# EAGLE board Imagenotifier (EAGLE 7.5.0), part 1 of 2
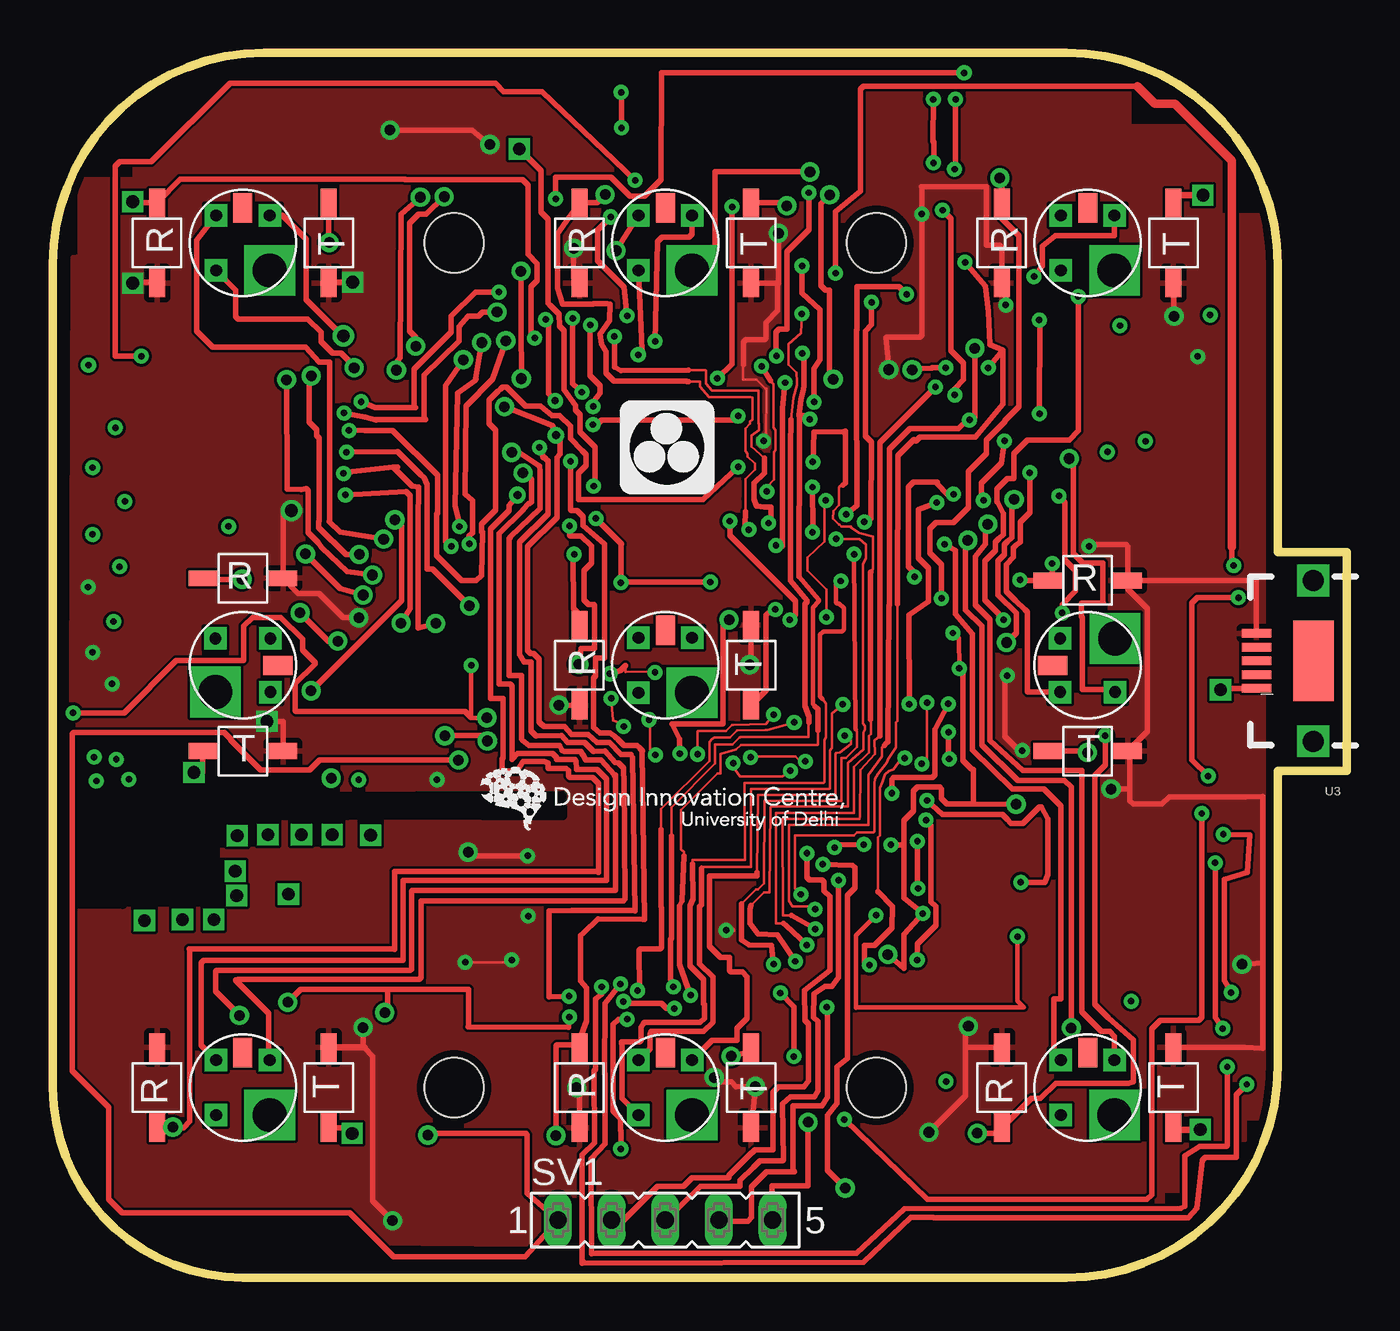
[diagram p1: board, top side]
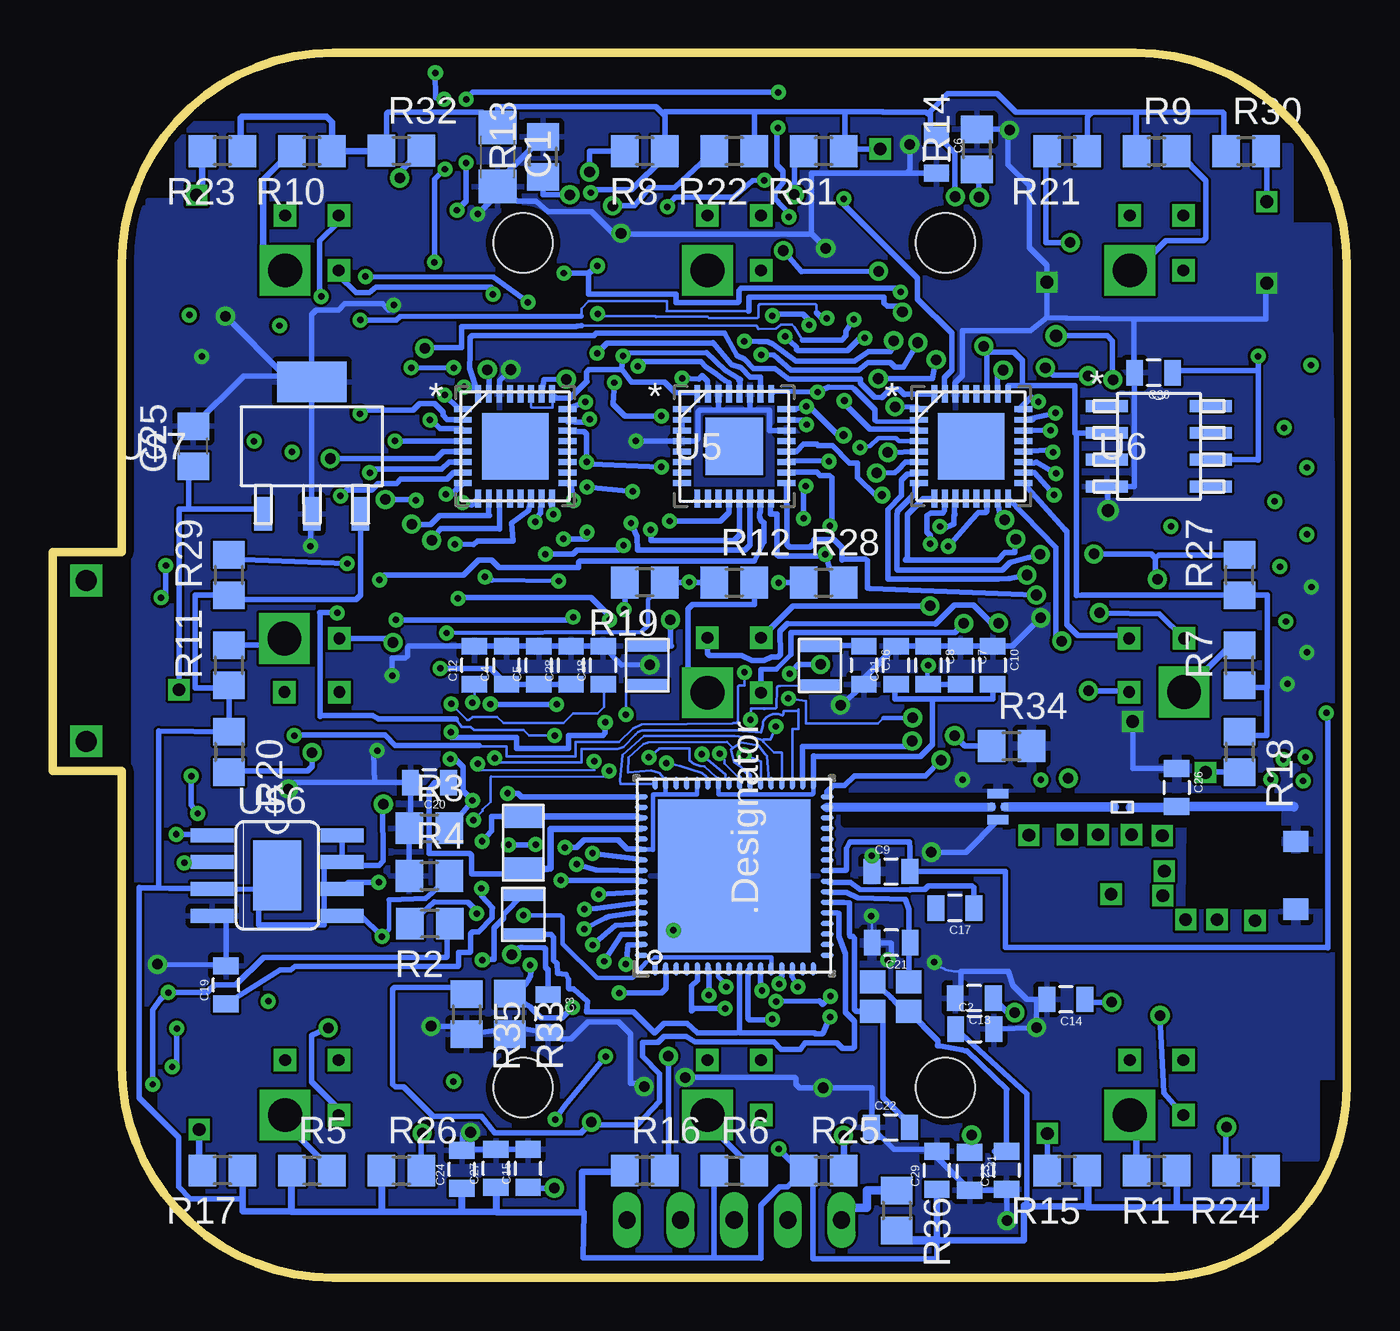
[diagram p2: board, bottom side, seen from below]

Size 61.26 x 58 mm. Coordinates in mm from the lower left corner, seen from the top.
Outline: 10,58 48,58 arc-90 58,48 58,34.37 61.27,34.37 61.27,24 58,24 58,10 arc-90 48,0 9,0 arc-90 0,9 0,48 arc-90 10,58
Copper layers (1*16): Top 0.035mm / dielectric 1.5mm / Bottom 0.035mm
Design rules "default *": minimum track width 5mil, minimum drill 10mil, track to track 5mil, track to pad 5mil, pad to pad 5mil, via to via 5mil, smd to smd 0mil, copper to edge 14mil, drill to drill 14mil, minimum pad ring 10mil, minimum via ring 8mil, stop-mask expansion 4mil, vias tented up to drill 0mil, thermal gap 10mil
Holes 2.8 mm at 39,49 19,9 39,9 19,49
tRestrict: area 3.3,17.8 to 24.2,22.9; area 0.9,17.7 to 3.3,19.8
bRestrict: area 3.3,17.7 to 23.8,22.8; area 0.8,17.7 to 3.3,19.9

## Footprints (pad centres in the part's own frame; a part is rotated, then mirrored left to right if it is on the bottom)
IRTRANSCIEVER = smd 1.35 x 0.75: 1 -1.9,0; 2 1.9,0
C1206 = smd 1.6 x 1.8: 1 -1.4,0; 2 1.4,0
0805 = smd 0.8 x 1.2: 1 -0.9,0; 2 0.9,0
C0805 = smd 1.3 x 1.5: 1 -0.95,0; 2 0.95,0
RGC0064A = smd 0.61 x 0.229: 1 -4.4,3.75; 2 -4.4,3.25; 3 -4.4,2.75; 4 -4.4,2.25; 5 -4.4,1.75; 6 -4.4,1.25; 7 -4.4,0.75; 8 -4.4,0.25; 9 -4.4,-0.25; 10 -4.4,-0.75; 11 -4.4,-1.25; 12 -4.4,-1.75; 13 -4.4,-2.25; 14 -4.4,-2.75; 15 -4.4,-3.25; 16 -4.4,-3.75; 33 4.4,-3.75; 34 4.4,-3.25; 35 4.4,-2.75; 36 4.4,-2.25; 37 4.4,-1.75; 38 4.4,-1.25; 39 4.4,-0.75; 40 4.4,-0.25; 41 4.4,0.25; 42 4.4,0.75; 43 4.4,1.25; 44 4.4,1.75; 45 4.4,2.25; 46 4.4,2.75; 47 4.4,3.25; 48 4.4,3.75 | smd 0.229 x 0.61: 17 -3.751,-4.4; 18 -3.251,-4.4; 19 -2.751,-4.4; 20 -2.251,-4.4; 21 -1.75,-4.4; 22 -1.25,-4.4; 23 -0.75,-4.4; 24 -0.25,-4.4; 25 0.25,-4.4; 26 0.75,-4.4; 27 1.25,-4.4; 28 1.75,-4.4; 29 2.251,-4.4; 30 2.751,-4.4; 31 3.251,-4.4; 32 3.751,-4.4; 49 3.751,4.4; 50 3.251,4.4; 51 2.751,4.4; 52 2.251,4.4; 53 1.75,4.4; 54 1.25,4.4; 55 0.75,4.4; 56 0.25,4.4; 57 -0.25,4.4; 58 -0.75,4.4; 59 -1.25,4.4; 60 -1.75,4.4; 61 -2.251,4.4; 62 -2.751,4.4; 63 -3.251,4.4; 64 -3.751,4.4 | smd 7.239 x 7.239: 65 0,0 | smd 0.508 x 0.508: V -1.136,0
ABS07-32.768KHZ-T = smd 1.092 x 1.905: P$1 -1.245,0; P$2 1.245,0
R0805 = smd 1.3 x 1.5: 1 -0.95,0; 2 0.95,0
FE05-1 = drill 0.813 long: 1 -5.08,0; 2 -2.54,0; 3 0,0; 4 2.54,0; 5 5.08,0
RHB32_3P15X3P15 = smd 0.838 x 0.279: 1 -2.475,1.75; 2 -2.475,1.25; 3 -2.475,0.75; 4 -2.475,0.25; 5 -2.475,-0.25; 6 -2.475,-0.75; 7 -2.475,-1.25; 8 -2.475,-1.75; 17 2.475,-1.75; 18 2.475,-1.25; 19 2.475,-0.75; 20 2.475,-0.25; 21 2.475,0.25; 22 2.475,0.75; 23 2.475,1.25; 24 2.475,1.75 | smd 0.279 x 0.838: 9 -1.75,-2.475; 10 -1.25,-2.475; 11 -0.75,-2.475; 12 -0.25,-2.475; 13 0.25,-2.475; 14 0.75,-2.475; 15 1.25,-2.475; 16 1.75,-2.475; 25 1.75,2.475; 26 1.25,2.475; 27 0.75,2.475; 28 0.25,2.475; 29 -0.25,2.475; 30 -0.75,2.475; 31 -1.25,2.475; 32 -1.75,2.475 | smd 3.15 x 3.15: 33 0,0
USB-MICRO-SMD = smd 1.4 x 0.4: D+1 2.7,0; D-1 2.7,0.65; GND1 2.7,-1.3; ID1 2.7,-0.65; VBUS1 2.7,1.3 | drill 1 square: P$1 0,3.81; P$2 0,-3.81 | smd 1.93 x 3.81: P$3 0,0
RHB32_2P7X2P7 = smd 0.838 x 0.279: 1 -2.475,1.75; 2 -2.475,1.25; 3 -2.475,0.75; 4 -2.475,0.25; 5 -2.475,-0.25; 6 -2.475,-0.75; 7 -2.475,-1.25; 8 -2.475,-1.75; 17 2.475,-1.75; 18 2.475,-1.25; 19 2.475,-0.75; 20 2.475,-0.25; 21 2.475,0.25; 22 2.475,0.75; 23 2.475,1.25; 24 2.475,1.75 | smd 0.279 x 0.838: 9 -1.75,-2.475; 10 -1.25,-2.475; 11 -0.75,-2.475; 12 -0.25,-2.475; 13 0.25,-2.475; 14 0.75,-2.475; 15 1.25,-2.475; 16 1.75,-2.475; 25 1.75,2.475; 26 1.25,2.475; 27 0.75,2.475; 28 0.25,2.475; 29 -0.25,2.475; 30 -0.75,2.475; 31 -1.25,2.475; 32 -1.75,2.475 | smd 2.718 x 2.718: 33 0,0
D8 = smd 1.981 x 0.559: 1 -2.464,1.905; 2 -2.464,0.635; 3 -2.464,-0.635; 4 -2.464,-1.905; 5 2.464,-1.905; 6 2.464,-0.635; 7 2.464,0.635; 8 2.464,1.905
1008IND2.2UH = smd 0.6 x 2: P$1 -0.95,0; P$2 0.95,0
Q24FA20H00396 = smd 1.2 x 1.1: 1 -0.85,-0.7; 2 0.85,-0.7; 3 0.85,0.7; 4 -0.85,0.7
SO08 = smd 0.66 x 2.032: 1 -1.905,-3.073; 2 -0.635,-3.073; 3 0.635,-3.073; 4 1.905,-3.073; 5 1.905,3.073; 6 0.635,3.073; 7 -0.635,3.073; 8 -1.905,3.073 | smd 3.327 x 2.286: P$1 0,0
MP04A = smd 3.302 x 1.905: GND 0,3.048 | smd 0.838 x 1.6: GND2 0,-3.2; IN -2.3,-3.2; OUT 2.3,-3.2
DEA202450BT-1294C1-H = smd 0.35 x 0.35: 1 0,-0.325; 3 0,0.325 | smd 0.45 x 1: 2 0.625,0; 4 -0.625,0
0402INDUCTOR3.6NH = smd 0.25 x 0.5: P$1 0.375,0; P$4 -0.375,0
ANTENNA-AH316M245001-T = smd 1 x 1.2: G 1.6,0; S -1.6,0
0.25WATT_RGB_THROUGH = drill 0.559 pad 1.016 square: B -1.27,1.3; G -1.27,-1.3; R 1.27,1.3 | drill 1.6 square: P2 1.27,-1.3 | smd 0.9 x 1.397: P$3 0,1.651
IRREIVER = smd 1.35 x 0.75: 1 -1.9,0; 2 1.9,0

## Placement (x,y rotation side)
1  IRTRANS  [IRTRANSCIEVER]  13.06,9 90 top
C1  33uF  [C1206]  40.21,53.07 270 bottom
C2  0.1uF  [0805]  17.61,11.78 0 bottom
C3  0.1uF  [0805]  37.82,12.5 270 bottom
C4  4.7uF  [0805]  39.78,29 90 bottom
C5  4.7uF  [0805]  38.25,29 90 bottom
C6  4.7uF  [0805]  19.43,53.21 270 bottom
C7  0.1uF  [0805]  18.29,29 270 bottom
C8  0.1uF  [0805]  19.81,29 270 bottom
C9  0.1uF  [0805]  21.58,19.24 0 bottom
C10  0.1uF  [0805]  16.76,29 270 bottom
C11  22uF  [0805]  21.34,29 90 bottom
C12  22uF  [0805]  41.3,29 90 bottom
C13  10uF  [0805]  17.64,13.24 180 bottom
C14  0.1uF  [0805]  13.3,13.18 180 bottom
C15  0.1uF  [0805]  38.76,5.18 90 bottom
C16  10uF  [0805]  22.86,29 270 bottom
C17  0.1uF  [0805]  18.56,17.5 180 bottom
C18  0.1uF  [0805]  35.2,29 90 bottom
C19  10pF  [0805]  53.06,13.87 90 bottom
C20  10pF  [0805]  43.43,23.44 180 bottom
C21  6.2pF  [0805]  21.57,15.86 180 bottom
C22  6.2pF  [0805]  21.6,7.12 0 bottom
C23  0.1  [0805]  16.1,5.08 90 bottom
C24  1uF  [0805]  41.9,5.13 90 bottom
C25  0.47uF  [C0805]  54.61,39.37 90 bottom
C26  1pF  [0805]  8.05,23.22 270 bottom
C27  100nF  [0805]  40.28,5.18 90 bottom
C28  100nF  [0805]  36.73,29 90 bottom
C29  10uF  [0805]  19.41,5.08 90 bottom
C30  10uF  [0805]  9.14,42.85 180 bottom
C31  0.1uF  [0805]  17.85,5.03 270 bottom
CC3200  Value  [RGC0064A]  29,19.02 90 bottom
CRYSTAL  ABS07-32.768KHZ-T  [ABS07-32.768KHZ-T]  38.99,20.6 270 bottom
R1  [R0805]  9,5.08 180 bottom
R2  100K  [R0805]  43.41,16.76 180 bottom
R3  100K  [R0805]  43.43,21.29 0 bottom
R4  100K  [R0805]  43.43,19.02 0 bottom
R5  [R0805]  49,5.08 0 bottom
R6  [R0805]  29,5.08 0 bottom
R7  [R0805]  5.08,29 90 bottom
R8  [R0805]  33.23,53.34 180 bottom
R9  [R0805]  9,53.34 0 bottom
R10  [R0805]  49,53.34 180 bottom
R11  [R0805]  52.92,29 90 bottom
R12  [R0805]  29,32.92 0 bottom
R13  [R0805]  38.05,53.08 90 bottom
R14  [R0805]  17.51,53.42 90 bottom
R15  [R0805]  13.23,5.08 180 bottom
R16  [R0805]  33.23,5.08 0 bottom
R17  [R0805]  53.23,5.08 180 bottom
R18  [R0805]  5.08,24.89 270 bottom
R19  [R0805]  33.23,32.92 180 bottom
R20  [R0805]  52.92,24.89 270 bottom
R21  [R0805]  13.23,53.34 180 bottom
R22  [R0805]  29,53.34 180 bottom
R23  [R0805]  53.23,53.34 180 bottom
R24  [R0805]  4.77,5.08 180 bottom
R25  [R0805]  24.76,5.08 0 bottom
R26  [R0805]  44.76,5.08 0 bottom
R27  [R0805]  5.08,33.27 90 bottom
R28  [R0805]  24.76,32.92 0 bottom
R29  [R0805]  52.92,33.27 90 bottom
R30  [R0805]  4.77,53.34 0 bottom
R31  [R0805]  24.76,53.34 180 bottom
R32  [R0805]  44.76,53.37 0 bottom
R33  100k  [R0805]  39.63,12.49 270 bottom
R34  100k  [R0805]  15.87,25.17 0 bottom
R35  2.7k  [R0805]  41.67,12.47 270 bottom
R36  100k  [R0805]  21.3,3.18 270 bottom
SV1  [FE05-1]  29,2.73 0 top
U1  TLC5941_RHB_32  [RHB32_3P15X3P15]  17.78,39.37 0 bottom
U2  TLC5941_RHB_32  [RHB32_3P15X3P15]  39.37,39.37 0 bottom
U3  [USB-MICRO-SMD]  59.69,29.21 180 top
U5  ADS7961_RHB_32  [RHB32_2P7X2P7]  29,39.37 0 bottom
U6  REF5025_D_8  [D8]  8.89,39.37 0 bottom
U$1  IND1UH1008P  [1008IND2.2UH]  33.12,29 270 bottom
U$2  IND2.6UH1008P  [1008IND2.2UH]  24.94,28.98 270 bottom
U$3  IND2.6UH1008P  [1008IND2.2UH]  38.99,17.2 90 bottom
U$5  Q24FA20H00396  [Q24FA20H00396]  21.59,13.31 180 bottom
U$6  FLASHM25PX80  [SO08]  50.64,19.04 270 bottom
U$7  LM3940  [MP04A]  49,39.37 0 bottom
U$8  DEA202450BT-1294C1-H  [DEA202450BT-1294C1-H]  16.51,22.3 270 bottom
U$9  IND3.6NH402P  [0402INDUCTOR3.6NH]  10.62,22.28 0 bottom
U$10  ANTENNAE-AH316M245001-T  [ANTENNA-AH316M245001-T]  2.41,19.05 270 bottom
U$11  RGBLED  [0.25WATT_RGB_THROUGH]  9,9 0 top
U$12  RGBLED  [0.25WATT_RGB_THROUGH]  9,29 270 top
U$13  RGBLED  [0.25WATT_RGB_THROUGH]  29,29 0 top
U$14  RGBLED  [0.25WATT_RGB_THROUGH]  49,9 0 top
U$15  RGBLED  [0.25WATT_RGB_THROUGH]  9,49 0 top
U$16  RGBLED  [0.25WATT_RGB_THROUGH]  49,29 90 top
U$17  RGBLED  [0.25WATT_RGB_THROUGH]  29,9 0 top
U$18  RGBLED  [0.25WATT_RGB_THROUGH]  29,49 0 top
U$19  RGBLED  [0.25WATT_RGB_THROUGH]  49,49 0 top
U$20  IRTRANS  [IRTRANSCIEVER]  53.06,49 270 top
U$22  IRTRANS  [IRTRANSCIEVER]  33.06,9 270 top
U$23  IRTRANS  [IRTRANSCIEVER]  53.06,9 90 top
U$24  IRTRANS  [IRTRANSCIEVER]  9,24.94 0 top
U$25  IRTRANS  [IRTRANSCIEVER]  33.06,29 90 top
U$26  IRTRANS  [IRTRANSCIEVER]  49,24.94 0 top
U$27  IRTRANS  [IRTRANSCIEVER]  13.06,49 270 top
U$28  IRTRANS  [IRTRANSCIEVER]  33.06,49 270 top
U$29  IRREC  [IRREIVER]  4.94,9 270 top
U$31  IRREC  [IRREIVER]  24.94,9 90 top
U$33  IRREC  [IRREIVER]  44.94,9 270 top
U$35  IRREC  [IRREIVER]  9,33.12 180 top
U$37  IRREC  [IRREIVER]  24.94,29 90 top
U$39  IRREC  [IRREIVER]  49,33.02 180 top
U$41  IRREC  [IRREIVER]  4.94,49 90 top
U$43  IRREC  [IRREIVER]  24.94,49 90 top
U$44  IRREC  [IRREIVER]  44.94,49 90 top

## Tracks (layer width: path | path; a pad name or v marks a point on that pad's centre or on a via)
BLANK  (via drill 0.3, 0.5)
  Top 0.127: v35.42,18.15 35.14,18.43 35.14,20.94 37.94,20.94 38.08,21.08 38.86,21.08 38.9,21.12 38.9,23.4 38.92,23.62 39.07,23.86 39.48,24.4 39.55,24.54 39.91,25.11 39.91,26.29 40,26.37 40,31.91
  Top 0.254: v40.69,42.99 40.73,43.05 41.62,43.06 41.65,43.09 v42.29,43.09 | 40,31.91 40.02,38.92 40.78,39.69 40.86,39.61 40.88,39.61 41.07,39.8 43.68,39.8 45,41.36 45,43.93 | v44.3,43.09 45,43.93 | v23.81,51.08 23.81,52.1 26.44,52.1 27.32,51.22 28.02,51.22 28.79,51.99 28.81,57.05 v43.15,57.05 | v42.75,55.8 42.75,52.5 v42.7,52.49 | v43.19,48.08 44.15,46.96 44.3,45.74 44.38,44.18 45,43.93
  Bottom 0.254: U2.31 40.61,41.85 40.61,42.54 40.71,43.03 v40.69,42.99 | CC3200.58 v35.42,18.15 | v42.29,43.09 42.41,43.07 v44.3,43.09 | v23.81,51.08 23.81,50.82 20.32,47.33 20.32,46.34 18.69,44.72 18.69,42.98 19.05,42.62 19.05,41.86 U1.31 | v43.15,57.05 43.13,55.87 v42.75,55.8 | v42.7,52.49 43.19,52.01 v43.19,48.08
CS  (via drill 0.3)
  Top 0.127: 32.61,17.71 33.28,18.38 33.39,18.38 33.68,18.67 33.69,22.58 37.34,22.58 37.35,22.59 37.34,22.59 37.34,24.6 37.36,24.61 37.55,24.61 38.07,25.14 38.07,25.85 38.03,25.96
  Top 0.203: 38.03,25.96 38.01,25.98 v37.94,34.26
  Top 0.254: v34.13,14.84 34.02,15.74 32.97,15.76 32.61,16.01 32.61,17.54 32.61,17.71 | v34.24,34.68 34.54,34.66 34.54,41.14 34.55,41.14 v34.68,42.38 | v25.58,40.4 25.78,40.4 25.99,40.61 32.23,40.61 v32.45,40.8
  Bottom 0.254: CC3200.63 34.02,15.77 v34.13,14.84 | U5.23 25.8,40.62 v25.58,40.4 | v32.45,40.8 34.17,40.8 34.73,41.36 v34.68,42.38 | v34.24,34.68 34.47,34.45 36.45,34.45 36.64,34.26 v37.94,34.26
GND  (via drill 0.3, 0.5, 0.6)
  Top 0.127: v19.53,14.94 21.48,14.94 arc45 v21.73,15.04 | v22.51,17.13 22.79,17.13 | v31.88,16.45 32.25,16.43 arc45 32.22,16.52 | v22.48,19.97 arc45 v22.49,19.97 22.51,19.95 | v33.66,39.62 33.77,39.7 33.79,42.1 33.74,42.1 33.33,42.52 32.7,42.52 32.69,42.53 32.69,43.22 32.7,43.23
  Top 0.254: U3.GND1 56.99,33.02 U$39.1 | 25.02,7.1 U$31.1 24.94,8.85 v24.79,8.99 | v11.3,36.32 10.9,36.32 U$35.1 11.62,32.4 12.6,32.4 13.76,31.25 v14.49,31.25 | v14.2,47.14 13.06,47.14 U$27.2 | U$41.1 5.08,47.1 5.08,47.14 3.78,47.14 v3.78,47.09 | v10.13,26.34 10.9,26.34 U$24.2 | U$22.2 33.09,7.1 v33.27,9.05 32.35,9.04 32.13,9.26 31.59,9.26 v31.32,9.48 | U$20.2 53.09,47.07 v53.09,45.53 | v49.06,34.64 49.13,34.7 50.83,34.7 50.9,34.63 U$39.1 | 51.01,23.2 51.01,24.83 U$26.2 51.83,25.87 51.83,31.68 50.9,32.62 U$39.1 | 51.01,23.2 51.01,22.57 51.15,22.42 52.52,22.42 52.87,22.77 56.47,22.77 57.3,22.8 57.3,14.9 | v14.69,11.85 14.69,10.97 14.76,10.9 14.76,10.88 15.15,10.49 15.15,3.63 v16.09,2.7 | v50.11,23.14 50.95,23.14 51.01,23.2 | v41.48,6.89 43.22,8.62 43.22,10.93 | 43.22,10.93 43.25,10.9 U$33.1 | v34.36,49.45 34.37,47.1 | 34.37,47.1 U$28.2 | v23.96,27.11 25.06,27.1 U$37.1 | v39.58,43 39.58,43.08 39.45,44.51 39.49,44.54 41.06,44.54 41.15,44.63 v41.15,50.36 41.15,51.63 41.12,51.66 44.2,51.66 44.2,48.89 44.82,48.89 44.94,48.77 U$44.1 | 44.94,48.04 U$44.1 | v33,29.03 33.06,29.03 U$25.2 | U$43.1 24.67,47.37 v24.67,48.75 | 57.3,14.9 57.28,10.85 56.42,10.9 U$23.2 | v56.31,14.84 57.3,14.9 | v43.35,11.91 43.22,11.77 43.22,10.93 | v15.97,54.34 19.86,54.34 v20.69,53.66 | v45.2,28.51 45.09,28.4 45.09,25.62 45.96,24.75 v45.91,24.96 | U$44.1 45.12,46.92 v45.12,46.06 | 32.7,43.23 32.7,44.3 32.82,44.42 33.7,44.42 33.77,44.49 33.77,45.23 34.32,45.79 34.32,47.06 34.37,47.1 | v19.67,20.15 19.84,19.97 v22.48,19.97
  Top 0.305: 1.2 14.76,10.9
  Bottom 0.127: 18.27,14.5 18.46,14.5 arc45 v19.53,14.94 | v21.73,15.04 arc-45 v21.73,15.04 21.7,15.02 21.77,15.02 arc-45 21.83,14.99 | C21.2 22.47,17.02 arc-45 v22.51,17.13 | CC3200.65 arc-45 29.89,18.66 32.24,16.3 32.24,16.24 arc45 v31.88,16.45 | C9.1 22.48,19.96 arc-45 v22.48,19.97
  Bottom 0.254: C20.2 44.33,21.33 R3.1 R4.1 | U6.4 11.3,37.46 | 11.3,37.46 v11.3,36.32 | 10.08,45.39 10.08,42.85 C30.2 10.04,37.46 11.3,37.46 | 14.2,45.47 13.26,45.43 10.08,45.39 | 14.2,45.47 v14.2,47.14 14.2,47.94 15.03,48.78 15.03,51.7 16.04,52.7 16.04,54.27 v15.97,54.34 16,54.37 R14.2 | v3.78,47.09 3.84,47.09 3.84,45.39 10.08,45.39 | C26.1 10.13,24.12 v10.13,26.34 | C15.2 C27.2 41.85,6.08 | 41.85,6.08 C24.2 | v53.09,45.53 50.26,42.7 | 50.26,42.7 49.98,42.42 U$7.GND | v49.06,34.64 49.06,36.11 U$7.GND2 U$7.GND | C25.2 52.23,42.7 50.26,42.7 | C2.2 14.7,11.84 v14.69,11.85 14.69,13.18 C14.2 15.14,13.18 15.81,13.85 16.01,14.5 18.27,14.5 18.27,13.5 C13.2 | C20.2 46.04,23.44 | 46.04,23.44 49.8,23.44 v50.11,23.14 | 41.85,6.08 41.85,6.09 41.85,6.81 41.77,6.89 v41.48,6.89 | 14.2,45.47 14.97,44.85 18.19,44.85 18.19,42.72 18.54,42.37 18.54,41.85 U1.30 | v14.49,31.25 15.84,29.9 C10.1 C7.1 C8.1 C11.2 22.86,28.38 C16.2 23.25,27.71 v23.96,27.11 | U5.22 27.33,40.1 27.33,41.05 27.36,41.09 28.25,41.09 | 28.25,41.09 U5.27 | v39.58,43 39.61,42.99 40.12,42.49 U2.30 | 28.25,41.09 29.74,41.09 29.75,41.08 U5.30 29.75,41.1 29.77,41.08 30.61,41.08 30.71,40.98 30.71,39.74 30.83,39.61 U5.4 v33.66,39.62 | C12.2 C4.2 C5.2 C28.2 C18.2 34.33,29.02 v33,29.03 | C12.2 41.27,29.87 | C20.2 44,23.78 | v31.32,9.48 26.14,9.48 26.07,9.41 26.07,9.16 25.91,8.99 v24.79,8.99 22.49,8.99 C22.1 21.44,6.07 19.41,6.07 C29.2 19.41,5.69 C31.2 16.15,4.13 C23.1 16.09,4.16 v16.09,2.7 | v24.67,48.75 25.32,49.4 | 25.32,49.4 34.49,49.4 | 34.49,49.4 34.69,49.4 35.77,50.48 37.82,50.48 38.37,50.96 39.25,50.96 C1.2 | U$6.4 53.06,17.09 C19.2 53.12,14.82 v56.31,14.84
  Bottom 0.254: v43.35,11.91 41.84,11.91 R35.2 39.6,11.8 R33.2 39.5,11.87 C3.2 37.2,11.32 | 37.11,11.28 37.2,11.32 | C6.2 20.82,52.31 | 20.82,52.31 25.34,52.31 25.35,52.29 25.35,49.43 25.32,49.4 | C1.2 40.21,51.87 R13.2 | C1.2 40.23,51.66 40.23,51.29 v41.15,50.36 | v45.91,24.96 46.09,24.84 46.04,23.44 | C12.2 41.32,29.92 44.41,29.92 44.48,29.85 44.48,29.45 44.58,29.35 45.18,29.35 45.2,29.33 v45.2,28.51 | v45.12,46.06 45.36,45.82 45.64,46.11 47.44,46.11 47.73,45.82 48.79,45.82 49,45.61 U$7.GND | v34.36,49.45 34.43,49.45 34.49,49.4 | 37.2,11.32 36.72,11.32 35.93,12.11 34.47,12.11 33.91,11.55 33.91,9.2 33.42,9.2 v33.27,9.05 | 21.77,15.02 21.56,15.22 21.56,15.82 21.6,15.86 C21.2 | U$8.2 18.04,20.15 v19.67,20.15 | v20.69,53.66 20.69,52.43 20.82,52.31
  Bottom 0.457: U$9.P$1 8.03,22.28 C26.2 2.51,22.32 2.51,22.3
  other vias: 2.81,28.12 1.88,29.61 1.67,32.71 54.21,43.62 18.19,23.58
  pour Bottom: 0.41,26.7 0.33,26.7 0.33,15.27 24.23,15.27 24.23,26.95 0.43,26.95 0.43,26.62
  pour Bottom: 9.13,57.37 50.38,57.37 50.38,57.03 51.63,57.03 51.63,54.64 55.27,54.64 55.27,54.29 55.38,54.29 55.38,50.99 56.75,50.99 56.75,50.64 57.43,50.64 57.43,9.28 56.18,9.28 56.18,6.31 53.9,6.31 53.9,2.21 51.4,2.21 51.4,1.18 5.95,1.18 5.95,2.43 4.02,2.43 4.02,5.63 1.4,5.63 1.4,9.5 0.61,9.5 0.61,13.38 0.39,13.36 0.84,49.84 2.65,49.84 2.65,53.61 4.93,53.61 4.93,55.54 8.91,55.54 8.91,57.48
  pour Top: 1.29,48.35 1.29,52 3.9,52 3.9,55.42 6.86,55.42 6.86,57.24 50.95,57.24 50.95,54.51 55.15,54.51 55.15,54.73 55.27,54.73 55.27,50.29 57.31,50.29 57.31,7.56 56.41,7.56 56.41,6.54 55.38,6.54 55.38,4.15 52.54,4.15 52.54,1.3 4.88,1.75 4.7,3.35 2.09,3.35 2.09,7.11 0.84,7.11 0.96,48.31
GPIOADC  (via drill 0.3)
  Top 0.127: 33.06,17.64 33.67,18.24 33.94,18.24 33.97,22.27 34.02,22.31 37.66,22.31 37.66,24.17 37.66,24.37 38.38,25.02 38.38,25.81 38.47,25.96 38.47,26.13 38.35,26.24 38.36,33.78 38.49,34.07 38.49,34.7 38.2,34.98 v37.09,34.98 | 33.97,42.48 34.13,42.32 34.13,40.25 34.21,40.14 34.21,39.19 34.15,39.1 34.15,37.78 33.81,37.45 v33.81,37.23
  Top 0.254: 33.06,17.64 33.02,17.46 33.02,16.77 CC3200.62 34.31,16.22 v35.16,14.98 | v33.56,43.15 33.97,42.48 | v35.97,37.44 36,35.5 v35.97,35.3
  Bottom 0.254: U5.29 29.24,41.86 29.24,42.28 arc-90 29.25,42.29 29.24,42.39 29.44,42.47 29.61,42.59 29.84,42.78 30.35,43.14 30.35,43.15 30.58,43.37 33.34,43.37 v33.56,43.15 | v33.81,37.23 v35.97,37.44 | CC3200.62 33.43,16.25 34.33,16.25 v35.16,14.98 | v35.97,35.3 35.95,35.27 35.95,35.03 36,34.98 v37.09,34.98
GSCLK  (via drill 0.3)
  Top 0.254: v14.6,41.48 15.27,41.19 17.18,41.19 17.11,41.26 17.11,43.03 18.85,44.77 18.85,45.52 20.01,46.68 v21.12,46.68 | v37.06,47.57 37.06,50.48 38.24,51.44 38.24,56.28 38.38,56.42 51.35,56.42 | v34.45,13.48 35.09,12.83 v35.09,10.48 | v37.48,7.5 41.41,3.7 51.81,3.7 52.03,3.93 52.03,11.77 52.45,12.19 54.27,12.19 54.4,12.33 v54.4,21.98 | v54.71,23.75 53.94,24.52 53.94,31.94 54.19,32.2 v56.14,32.2 | v55.91,33.72 55.83,33.8 55.83,34.59 | v35.47,47.91 35.47,46.61 36.31,45.84 36.31,43.46 36.04,43.06 v36.05,41.47
  Top 0.406: 51.35,56.42 52.17,55.6 53.13,55.6 55.83,52.9 55.83,34.59
  Bottom 0.254: U1.24 15.34,41.08 15.53,41.08 15.53,41.1 14.93,41.7 v14.6,41.48 | v21.12,46.68 21.29,46.85 28.68,46.85 28.78,46.75 28.78,46.23 28.84,46.17 31.76,46.17 31.76,46.57 35.89,46.57 35.89,47.52 v35.47,47.91 35.94,47.57 v37.06,47.57 | v36.05,41.47 36.9,41.14 U2.24 | CC3200.2 32.24,14.61 | CC3200.2 32.27,14.61 32.26,14.6 | CC3200.2 32.23,14.6 32.23,13.7 32.45,13.48 v34.45,13.48 | v35.09,10.48 37,8.15 v37.48,7.5 | v54.4,21.98 54.71,22.38 v54.71,23.75 | v56.14,32.2 55.91,32.43 v55.91,33.72
IN0  (via drill 0.38, 0.5)
  Top 0.254: v5.69,7.13 4.97,7.13 U$29.2 6.19,7.1 6.48,7.39 6.48,15.55 6.46,15.57 16.15,15.57 16.19,15.54 16.19,19.24 25.79,19.24 25.83,19.19 25.83,23.4 25.56,23.68 24.48,23.68 24.41,23.75 24.41,24.02 24.31,24.12 23.47,24.12 23.46,24.14 23.46,24.38 23.25,24.44 22.26,24.44 21.97,23.99 21.38,23.99 21.27,24.1 21.27,24.56 21.31,24.6 21.31,27.44 20.74,27.44 20.74,27.43 20.74,35.46 21.61,36.33 21.61,36.55 v22,37.06
  Bottom 0.254: R24.2 5.72,7.11 v5.69,7.13 | v22,37.06 22.06,37.04 22.3,37.04 23.16,37.9 23.16,38.58 23.54,38.58 24.36,39.41 25.02,39.41 25.09,39.47 25.71,39.47 26.06,39.12 U5.20
IN1  (via drill 0.3, 0.5)
  Top 0.254: v23.83,6.73 23.83,10.98 23.88,11.04 24.8,11.04 U$31.2 24.94,11.27 25.28,12.16 25.27,13.72 24.99,14.05 24.99,16.2 25.1,16.31 25.81,16.99 27.94,16.96 28.01,16.96 27.91,24.93 27.91,24.95 27.79,25.06 27.79,25.08 27.67,25.2 27.1,25.2 27.09,25.21 27.04,25.21 26.77,25.49 26.77,25.5 26.66,25.59 26.63,25.62 26.39,25.8 25.91,25.79 25.61,26.06 25.61,28.39 25.71,28.48 25.71,29.34 25.72,29.35 26.08,29.35 26.12,29.35 26.12,34.75 25.27,35.47 25.11,35.61 25.1,35.62 25.1,36.04 24.81,36.33 24.55,36.33 24.51,36.37 v24.52,38.66
  Bottom 0.254: U5.19 26.46,38.68 v24.52,38.66
  Bottom 0.305: v23.83,6.73 v23.82,6.73 R25.2
IN2  (via drill 0.3, 0.5)
  Top 0.127: 27.13,29 27.13,28.68 28.47,28.7 v28.51,28.67
  Top 0.254: v43.78,6.84 44.68,6.84 U$33.2 46.33,8.5 46.77,8.5 47.48,9.21 50.93,9.21 51.17,9.28 51.17,11.27 49.97,12.3 49.33,12.94 49.33,23.78 49.83,24.28 v49.83,25.67 | 25.56,29.81 25.65,29.79 | v24.92,29.04 25,29.79 25.65,29.79 | 27.13,29 26.88,28.75 v26.38,28.6 | 25.65,29.79 25.65,31.84 25.62,31.87 25.37,31.87 25.15,32.1 25.15,33.47 25.5,33.83 25.5,34.64 25.02,35.13 24.5,35.13 24.47,35.16 v24.47,35.59
  Bottom 0.127: v24.92,29.04 25,28.98 | v28.51,28.67 28.52,28.64 28.51,28.05 28.77,28.05 28.83,28 28.83,26.35 28.9,26.28 29.04,26.28 29.09,26.25 33.39,26.2 33.8,26.01 34.46,25.36 36.53,25.36 36.53,24.69 39.78,24.69 39.78,25.16 41.08,25.16 41.08,25.19
  Bottom 0.254: U5.18 26.23,38.14 25.08,38.14 24.93,37.99 24.49,37.99 24.38,37.88 24.38,35.68 v24.47,35.59 | v43.78,6.84 43.82,6.8 R26.2 | 49.65,25.84 v49.83,25.67 49.8,25.69 45.52,25.69 45.05,25.19 41.08,25.19 | v26.38,28.6 25.98,29.04 v24.92,29.04
IN3  (via drill 0.5)
  Top 0.254: U$35.2 7.15,33.07 v8.96,33.07 | v11.97,34.27 13.6,32.64 v14.69,32.32
  Bottom 0.254: v8.96,33.07 9.05,33.16 9.05,34.07 | 9.05,34.07 8.9,34.22 R27.2 | 9.05,34.07 9.25,34.27 v11.97,34.27 | v14.69,32.32 22.57,32.64 22.69,32.66 22.69,33.95 22.79,34.04 23.85,34.04 23.91,33.98 23.91,34.57 24.28,34.95 25.23,34.95 25.23,34.79 25.42,34.6 26.38,34.6 26.5,34.72 26.5,36.61 26.53,36.64 U5.17
IN4  (via drill 0.3)
  Top 0.254: v24.69,34.25 24.63,34.21 24.65,31.69 24.94,31.41 U$37.2
  Bottom 0.254: U5.16 27.29,36.85 27.29,36.15 26.97,36.15 26.97,36.01 26.97,34.23 26.9,34.16 24.78,34.16 v24.69,34.25 24.49,33.6 R28.2
IN5  (via drill 0.3)
  Top 0.254: v45.79,33.04 46.04,33.02 U$39.2 47.31,33.02 v47.32,33.82
  Bottom 0.254: U5.15 27.76,36.28 arc-90 27.59,35.75 27.59,34.83 28.04,33.97 28.07,33.94 36.29,33.94 36.38,33.86 36.38,33.63 36.39,33.62 40.13,33.62 40.5,33.98 41.11,33.98 41.81,33.28 45.55,33.28 v45.79,33.04 | R29.2 52.92,34.02 v47.32,33.82
IN6  (via drill 0.3, 0.6)
  Top 0.127: 30.11,42.98 30.89,42.98 30.92,42.95 30.92,42.34 31.2,41.99 33.42,41.99 33.42,40.86 33.42,40.44 33.43,40.44 33.43,40.14 33.08,39.87 33.08,39.36 33.7,38.8
  Top 0.254: v3.78,50.95 arc90 3.84,50.9 U$41.2 6.04,52 16.68,52 16.69,52 22.24,52 22.5,51.74 22.5,48.46 22.94,48.02 22.94,47.22 22.65,46.94 22.65,44.62 v22.82,44.5 | v26.59,44.57 26.6,43.12 26.91,42.96 30.11,42.98 | 33.7,38.8 33.7,38.1 33.2,37.62 33.2,36.86 33.31,36.53 33.7,36.49 34.01,36.49 34.01,35.76 v33.89,35.73
  Bottom 0.254: R30.2 arc90 3.78,53.31 v3.78,50.95 | U5.14 28.25,34.7 28.49,34.46 33.59,34.46 33.59,35.1 v33.89,35.73 | v22.82,44.5 23.02,44.51 23.64,43.89 25.99,43.89 26.05,43.95 26.05,44.07 v26.59,44.57
IN7  (via drill 0.3, 0.5)
  Top 0.127: 30.1,42.43 30.65,42.43 30.66,42.42 30.66,42.2 31.06,41.69 33.04,41.69 33.12,41.68 33.12,40.63 33.02,40.53 33.02,40.45 32.79,40.22 32.79,39.14 32.9,39.03 32.9,38.88 33.24,38.54 33.24,38.28 32.79,37.82 32.79,36.87 32.79,36.27
  Top 0.254: v26.15,51.29 25.76,50.9 U$43.2 23.89,49.43 23.89,46.86 24.13,46.1 25.59,46.11 25.6,46.11 26.24,46.11 26.38,46.1 26.35,45.32 25.92,44.68 25.98,44.2 26.19,43.86 26.19,42.83 26.45,42.57 26.46,42.57 26.58,42.45 30.01,42.45 30.03,42.43 30.1,42.43 | v32.96,35.42 32.78,35.63 32.79,36.27
  Bottom 0.254: 28.75,36.28 U5.13 28.75,35.16 29.01,34.9 32.95,34.9 v32.96,35.42 | R31.2 26.15,52.91 v26.15,51.29
IN8  (via drill 0.3, 0.5)
  Top 0.254: v44.84,52.07 44.94,51.98 U$44.2 44.94,50.16 45.75,49.34 45.75,41.25 45.08,40.59 45.08,40.54 44.2,39.66 44.2,39.02 43.36,38.17 43.36,36.46 42.64,35.75 41.82,35.75 41.54,35.46 41.54,34.31 42.08,33.76 v42.08,32.16 | v32.06,35.83 32.06,35.15 35.16,32.05 35.16,31.41 v34.9,31.15
  Bottom 0.254: R32.2 44.84,52.34 v44.84,52.07 | U5.12 29.25,36.23 29.65,35.83 v32.06,35.83 | v34.9,31.15 34.9,31.33 35.78,32.21 42.03,32.21 v42.08,32.16
MISO  (via drill 0.3)
  Top 0.127: 29.88,19.96 29.88,20.15 29.75,20.28 29.75,22.16 31.47,23.87 31.61,23.87 31.63,24.81 32.36,25.01 32.6,25.21 35.57,25.21 35.58,25.22 36.21,25.22 36.24,25.25 36.24,25.91
  Top 0.203: 36.1,27.06 35.98,27.17 35.98,31.74 36.28,32.04 36.28,32.1 35.33,33.19
  Top 0.254: 35.34,40.82 35.43,41.61 35.55,42.06 35.58,42.23 35.58,43.51 v35.49,43.77 | 29.88,19.96 29.8,17.84 29.68,17.61 29.68,14.83 v30.2,13.37 | 36.1,27.06 36.23,26.92 36.23,26.22 36.24,26.22 36.24,25.91 | 35.33,33.19 35.36,39.89 35.36,39.92 35.36,40.78 35.34,40.82 | 35.34,40.82 35.67,40.82 v35.84,40.64
  Bottom 0.254: U5.26 27.76,42.62 27.76,42.65 28.25,42.65 28.68,43.1 29.12,43.24 30,44.28 30.02,44.26 35.02,44.26 35.35,43.92 v35.49,43.77 | v35.84,40.64 35.89,40.66 36.1,40.51 36.55,40.52 36.9,40.54 U2.23 | CC3200.6 30.2,14.57 v30.2,13.37
MODE  (via drill 0.3, 0.33, 0.5)
  Top 0.127: v36.1,17.44 35.96,17.58 35.03,17.58 34.85,17.84 34.85,21.43 34.86,21.45 38.5,21.45 38.62,21.44 38.62,23.8 39.27,24.68 39.27,25.1 39.37,25.2
  Top 0.254: v43.66,44 43.66,40.72 v43.41,40.62 43.31,40.62 42.89,40.2 40.58,40.2 39.61,39.23 39.61,31.85 39.6,31.83 39.55,25.36 39.45,25.29 39.37,25.2 | 23.81,41.56 v23.78,41.53 23.48,41.86 23.48,44.65 23.47,45.31 v23.34,45.37
  Bottom 0.127: 25.77,44.4 26.15,45.01 26.26,45.13 26.8,45.14 27.02,44.95 27.86,44.93 27.95,45.08 36.2,45.09 36.24,45.08
  Bottom 0.254: U1.3 20.32,40.18 22.57,40.18 23.78,41.4 v23.78,41.53 | v23.34,45.37 23.39,45.29 23.7,44.83 23.7,44.6 23.91,44.4 25.77,44.4 | U2.3 41.93,40.2 42.93,40.2 43.35,40.62 v43.41,40.62 | 36.24,45.08 36.45,45.05 36.51,45.03 41.92,45.03 41.92,44.03 43.28,44.03 v43.66,44 | CC3200.59 35.53,17.49 36.12,17.44 v36.1,17.44
MOSI  (via drill 0.3)
  Top 0.127: 32.52,25.59 32.54,25.59 | 29.29,20.91 29.29,22.27 31.35,24.34 31.35,25.26 32.18,25.25 32.52,25.59 | 35.8,26.3 35.79,26.28 35.79,25.62 35.78,25.61 32.56,25.61 32.54,25.59 32.52,25.59 | 34.95,40.63 35.07,41.68 35.24,42.26 35.24,42.44 35.22,42.87 34.82,43.24 34.82,44.2 35.43,44.73 v35.46,45.64
  Top 0.254: v29.39,13.77 29.24,14.16 29.24,16.02 29.29,16.08 29.29,20.91 | 35.8,26.3 35.8,26.57 35.62,27.06 35.62,31.9 35.72,32 35.72,32.06 34.93,33.01 34.93,39.29 34.93,39.36 34.95,40.63 | v24.62,45.43 24.62,42.33 v25.05,41.93
  Bottom 0.127: v35.46,45.64 35.4,45.53 32.73,45.53 32.69,45.49 32.66,45.51 30.27,45.51 30.19,45.43 27.92,45.43 27.86,45.49 27.86,46.04 27.8,46.1 25.15,46.1 25.11,46.06 25.11,45.69
  Bottom 0.203: CC3200.7 29.76,14.27 29.46,13.97 v29.39,13.77 | U1.2 20.34,40.54 21.43,40.54 22.25,40.55 arc90 22.34,40.62
  Bottom 0.254: CC3200.7 | 27.17,41.92 U5.25 27.11,41.98 v25.05,41.93 24.55,42.16 23.41,42.15 23.31,42.07 22.34,41.1 22.34,40.62 | v24.62,45.43 24.85,45.43 25.11,45.69
N$1  (via drill 0.3, 0.5)
  Top 0.127: v26.44,27.43 26.54,26.41 26.52,26.39 26.94,26.24 v27.03,26.1
  Top 0.203: 19.8,29.02 v19.81,29 19.81,29.02 19.81,26.52 19.82,26.51 v20.55,26.51
  Top 0.254: v0.97,26.75 3.37,26.75 5.84,29.21 9.01,29.21 9.05,29.26 9.05,30.86 9.46,31.27 10.79,31.27 11.82,30.24 11.82,29.73 12.42,29.13 12.42,29.07 11.47,28.13 11.47,26.85 11.51,26.81 19.52,26.81 19.81,26.52
  Bottom 0.127: CC3200.36 26.74,23.44 26.74,24.85 26.76,24.87 27.11,24.87 27.61,25.37 | 27.61,25.37 27.61,25.49 27.28,25.49 v27.03,26.1 | v26.44,27.43 25.61,27.3 25.61,26.24 22.2,26.24 21.93,26.51 | 27.61,25.37 27.69,25.45 28,25.55 28.76,25.62 29,25.64 30.72,25.64 | 30.72,25.64 30.72,25.66 | 30.72,25.64 33.27,25.64 34.29,24.76 34.41,23.55 34.39,23.37 32.8,23.37 CC3200.48
  Bottom 0.203: 19.86,28.1 19.86,28.97 v19.81,29 | v20.55,26.51 21.93,26.51
  Bottom 0.254: C7.2 C8.2 19.86,28.1 | CC3200.25 24.58,19.3 23.72,19.3 23.68,19.34 23.68,20.34 23.51,20.63 20.69,20.63 20.68,20.32 C9.2 16.18,19.24 16.17,19.24 16.17,15.64 0.91,15.64 0.89,15.62 0.89,26.67 v0.97,26.75
N$2  (via drill 0.3, 0.5)
  Top 0.254: v29.69,24.82 29.67,25.51 29.32,26.22 31.72,26.22 31.74,26.24 31.74,30.87 v32.02,31.15
  Bottom 0.127: v29.69,24.82 29.45,24.51 29.45,24.35 28.75,23.65 CC3200.40
  Bottom 0.254: CC3200.40 28.75,23.67 | v32.02,31.15 32.02,29.94 31.98,29.9 33.08,29.9 U$1.P$1
N$3  (via drill 0.3)
  Top 0.127: v34.13,26.66 33.76,26.22 32.2,26.18 32.15,26.18 31.87,25.89 30.56,25.89 30.53,25.86 30.53,24.82 v30.53,24.79
  Bottom 0.127: CC3200.41 29.42,23.65 29.42,23.82 30.27,24.54 30.51,24.8 v30.53,24.79 | U$1.P$2 34.12,28.05 34.12,26.71 v34.13,26.66
N$4  (via drill 0.3)
  Top 0.127: v41.15,24.33 41.27,24.4 41.4,24.4 v41.4,27.23 | v33.04,24.64 33.09,24.69 35.15,24.69 35.4,24.45 v35.63,24.45
  Bottom 0.127: CC3200.33 | CC3200.42 29.75,23.59 29.87,23.71 30.4,24.21 30.63,24.23 30.9,24.32 31.11,24.48 31.11,25.06 32.56,25.06 32.56,25.05 v33.04,24.64 | v41.4,27.23 41.3,27.21 C12.1 | v41.15,24.33 41.05,24.03 35.61,24.03 35.62,24.21 v35.63,24.45
  Bottom 0.203: CC3200.33 25.26,23.41 25.26,22.92 25.29,22.88 29.75,22.88 29.75,22.89 CC3200.42
  Bottom 0.254: CC3200.33 CC3200.33 arc-90 25.24,23.43 25.24,24.71 arc-90 25.2,24.68 20.19,24.68 19.62,25.24 19.62,27.37 19.6,27.39 | C10.2 16.76,27.39 19.6,27.39 | 19.6,27.39 21.39,27.39 21.39,28.1 C11.1
N$5  (via drill 0.3, 0.5)
  Top 0.254: v11.13,13.04 11.74,13.66 15.84,13.66 | 15.84,13.66 15.84,13.65 19.69,13.65 19.69,11.92 19.65,11.88 24.43,11.85 v24.46,12.35 | v15.72,12.55 15.84,12.67 15.84,13.66
  Bottom 0.254: 12.4,13.09 C14.1 12.26,13.04 v11.13,13.04 | C13.1 16.05,12.55 v15.72,12.55 | U$3.P$1 37.67,16.25 37.54,16.12 37.54,15.02 37.4,14.87 37.37,14.42 36.98,14.37 36.85,14.14 36.85,13.73 36.79,13.67 36.6,13.68 35.95,13.09 35.99,12.58 33.76,12.58 32.78,11.6 32.33,12.05 31.24,12.05 30.75,11.6 28.89,11.6 28.77,11.62 | v24.46,12.35 24.81,11.58 24.84,11.54 25.16,11.54 25.2,11.6 28.73,11.6 28.77,11.62 | 28.75,14.6 28.78,14.6 CC3200.9 28.76,14.6 28.76,11.65 28.77,11.62
N$6  (via drill 0.3)
  Top 0.127: v32.22,24.36 32.17,24.24 32.54,23.74 34.54,23.74 v34.92,24
  Top 0.254: v41.34,21.67 41.59,21.42 41.59,17.8 41.81,17.57 41.81,16.69 40.93,15.81 v40.93,15.04
  Bottom 0.127: CC3200.43 30.34,23.42 30.34,23.75 30.37,23.75 30.52,23.9 31.57,24.23 v32.22,24.36 | v41.34,21.67 40.9,22.11 40.9,22.17 40.54,22.53 40.54,23.69 40.51,23.73 35.1,23.72 v34.92,24
  Bottom 0.254: U$3.P$2 39.93,17.21 39.93,17.02 40.36,16.55 40.38,15.07 40.77,15.07 v40.93,15.04
N$7  (via drill 0.3, 0.5)
  Top 0.254: v36.46,19.58 37.87,19.53 37.98,19.42 37.98,18.47 37.63,18.11 37.63,10.38 37.12,9.99 37.12,8.25 36.69,7.69 36.69,5.08 v37.52,4.24
  Bottom 0.254: CC3200.56 35.55,19.3 v36.46,19.58 | C15.1 38.72,4.24 v37.52,4.24
  Bottom 0.305: C15.1 38.86,4.28 38.86,4.19
N$8  (via drill 0.3)
  Top 0.127: v28.53,24.75 28.29,25.02 28.29,26.24 28.28,26.25 v28.23,26.42
  Bottom 0.127: U$2.P$2 24.96,28.04 26.85,28.02 arc-90 26.99,27.88 27,27.06 arc90 27.06,26.95 27.56,26.94 arc90 27.6,26.94 28.21,26.94 28.21,26.41 v28.23,26.42 | CC3200.38 27.73,23.44 27.73,24.44 28.44,24.73 v28.53,24.75
N$9
  Bottom 0.254: C16.1 22.89,29.93 U$2.P$1
N$10  (via drill 0.3)
  Top 0.254: v42.4,27.17 41.77,25.95 41.77,23.94 41.77,23.81 41.64,23.68 39.81,23.68 39.73,23.6 v39.73,22.94
  Bottom 0.127: 35.12,28.01 35.16,27.96 35.16,27.02 35.46,26.72 36.62,26.72 37.08,26.27 39.93,26.27 40.22,26.56 41.4,26.56 41.54,26.41 41.64,26.41 v42.4,27.17
  Bottom 0.254: C18.1 35.12,28.01 | CC3200.49 39.07,22.77 39.24,22.94 v39.73,22.94
N$11
  Bottom 0.254: CC3200.24 24.55,18.72 23.49,18.72 23.04,18.38 20.69,18.36 20.67,18.39 19.97,18.39 19.79,18.56 17.74,18.56 17.66,18.48 C17.1
N$12  (via drill 0.3)
  Top 0.254: v40.94,20.67 40.94,18.49 v40.97,18.43
  Bottom 0.254: C19.1 50.5,14.58 50,14.58 49.8,14.74 42.08,14.74 42.05,14.8 42.05,15.41 41.52,15.41 41.48,15.45 41.48,16.28 41.39,16.37 41.11,16.37 40.45,17.03 40.45,17.47 40.45,17.52 40.97,18.07 v40.97,18.43 | CRYSTAL.P$1 40.49,21.84 40.49,21.16 v40.94,20.67
  Bottom 0.305: CC3200.51 33.48,21.77 33.55,21.84 CRYSTAL.P$1
N$13
  Bottom 0.254: C20.1 43.19,23.44 43.44,23.12 43.44,20.63 43.44,20.15 43.44,20.08 41.53,20.08 41.45,19.99 41.45,19.15 41.41,19.12 39.23,19.12 CRYSTAL.P$2
  Bottom 0.305: CC3200.52 33.42,21.26 37.7,21.25 37.7,19.37 37.85,19.35 CRYSTAL.P$2
N$14
  Bottom 0.254: CC3200.23 24.57,18.24 23.69,18.24 23.15,17.97 20.9,17.91 20.73,17.45 20.73,15.98 C21.1 20.74,15.79 U$5.1
N$15
  Bottom 0.254: CC3200.22 23.83,17.78 23.54,17.74 23.54,16.28 23.52,16.17 23.39,16.17 23.31,16.08 23.31,12.72 23.2,12.61 U$5.3 21.96,12.13 21.96,8.55 20.7,7.29 C22.2
N$16
  Bottom 0.254: 22.14,14.01 U$5.2 22.06,13.63 21.96,13.63 21.57,13.28 21.56,13.24 20.95,12.61 U$5.4 | 16.69,5.98 C23.2 16.1,8.91 16.1,8.92 17.98,10.74 18.06,10.74 18.22,10.78 19.38,11.01 19.35,10.98 19.35,11.22 U$5.4 | 20.39,12.96 U$5.4
N$17  (via drill 0.3)
  Top 0.254: 25.07,0.69 25.05,5.81 25.66,6.39 25.62,9.79 25.69,9.86 25.69,9.9 25.7,9.9 25.7,11.6 25.7,11.69 25.7,13.21 25.99,13.41 v25.99,13.77 | 25.14,0.76 25.07,0.69 | 25.07,0.69 38.38,0.73 40.63,2.86 41.68,2.86 41.72,2.84 53.78,2.84 54.17,3.29 54.43,5.57 54.57,5.71 56.03,5.71 56.03,8.65 v56.54,9.16 | v55.8,13.5 55.47,14.09 55.47,18.85 56.55,19.2 56.68,20.97 v55.42,20.99
  Bottom 0.203: U$6.1 53.15,20.99 53.69,20.99
  Bottom 0.254: CC3200.14 26.26,14.27 v25.99,13.77 | v56.54,9.16 56.54,12.69 56.18,13.17 55.85,13.5 v55.8,13.5 53.96,13.5 53.6,13.86 52.6,13.86 51.29,15.16 42.64,15.16 42.59,15.22 42.59,16.64 R2.1 | v55.42,20.99 53.69,20.99
N$18  (via drill 0.3)
  Top 0.254: v26.88,13.91 26.16,13 26.12,9.67 26.14,9.66 26.16,6.34 25.49,5.63 25.5,1.14 25.72,1.16 38.05,1.16 40.33,3.27 53.41,3.29 53.61,3.38 53.61,5.77 54.3,6.22 55.56,6.22 55.61,6.27 v55.61,9.98 | v55.4,11.8 55.03,12.34 v55.03,19.64
  Bottom 0.254: CC3200.13 26.75,14.26 26.98,14.03 v26.88,13.91 | v55.61,9.98 55.4,10.2 v55.4,11.8 | v55.03,19.64 54.75,19.66 U$6.2
N$19  (via drill 0.3)
  Top 0.127: v35.11,26.29 33.85,25.93 33.75,25.95 32.4,25.91 32.07,25.58 31.32,25.58 31.22,25.51 31.09,25.38 31.09,24.47 28.8,22.19 28.8,21.22
  Top 0.254: v27.69,13.59 27.79,13.65 27.76,15.5 27.83,15.57 28.75,15.57 28.82,15.64 28.82,17.49 28.8,17.61 28.8,21.22 | v42.41,25.83 42.41,24.76 v42.44,24.56 | v41.4,22.6 42.13,21.94 44.96,21.94 45.2,21.7 45.2,21.69 45.37,21.52 45.94,21.52 46.7,22.28 46.81,22.28 47.11,21.72 47.11,19.1 46.97,18.72 v45.83,18.72
  Bottom 0.254: CC3200.11 | CC3200.11 27.75,14.11 | CC3200.11 27.75,13.76 27.73,13.68 v27.69,13.59 | v35.11,26.29 35.11,25.79 35.2,25.69 36.85,25.69 36.85,25.06 39.31,25.06 39.31,25.57 42.41,25.57 v42.41,25.83 42.41,25.61 | v42.44,24.56 42.31,24.66 41.84,24.2 41.84,23.05 v41.4,22.6 R3.2 | U$6.6 47.25,18.72 v45.83,18.72
N$20  (via drill 0.6)
  Top 0.254: v55.3,27.84 55.3,27.91 U3.VBUS1
  Bottom 0.254: 54.84,36.4 54.84,38.42 C25.1 | U$7.IN 51.3,36.4 54.84,36.4 | 54.84,36.4 55.27,36.4 55.27,27.84 v55.3,27.84
N$22
  Bottom 0.457: CC3200.31 U$8.1 | U$8.1
N$23
  Bottom 0.457: U$8.3 10.99,22.3 U$9.P$4
N$24
  Bottom 0.305: U$11.P2 9.95,7.7 R1.2
N$25
  Bottom 0.305: R5.2 50.27,7.3 U$14.P2
N$26
  Bottom 0.254: R6.2 30.27,7.3 U$17.P2
N$27
  Bottom 0.254: U$12.P2 5.48,29.95 R7.2
N$28  (via drill 0.5)
  Top 0.254: v35.85,52.36 31.36,52.36 31.36,48.51 31.08,48.51 U$18.P2
  Bottom 0.254: R8.2 35.86,53.34 v35.85,52.36
N$29
  Bottom 0.254: U$15.P2 9.95,47.7 8.56,49.1 6.78,49.1 6.66,49.22 6.66,51.95 R9.2
N$30
  Bottom 0.305: R10.2 51.31,51.98 51.31,48.08 50.93,47.7 U$19.P2
N$31
  Bottom 0.254: U$16.P2 50.62,29.95 R11.2
N$32
  Bottom 0.254: U$13.P2 31.19,28.62 31.19,31.66 30.97,31.88 28.05,31.88 28.05,32.08 R12.2
N$33  (via drill 0.3)
  Top 0.254: U$11.R 10.21,10.36 10.21,12.52 8.66,14.08 8.66,14.11 8.78,14.13 17.35,14.13 17.44,14.23 17.44,17.83 27.01,17.83 27.1,17.92 27.06,23.72 27.03,23.8 27.03,24.13 26.78,24.38 26.61,24.4 26.15,24.94 25.61,24.92 25.17,25.35 24.38,25.35 24.08,25.66 22.87,25.66 22.69,25.84 22.64,25.89 22.64,29.15 22.58,29.15 22.58,29.16 22.31,29.16 22.1,29.51 22.1,34.73 22.09,34.83 22.09,34.84 23.45,36.16 23.45,38.69 23.36,38.75 23.36,38.76 23.28,38.84 23.22,38.84 23.21,38.85 v23.04,39.31
  Bottom 0.203: U1.4 21.19,39.62 21.33,39.76 22.17,39.76 22.57,39.37 v23.04,39.31
N$34  (via drill 0.5)
  Top 0.254: v8.84,12.42 7.71,13.55 7.71,14.51 7.76,14.56 16.93,14.56 16.98,14.61 16.98,18.3 17.01,18.33 26.61,18.33 26.64,18.36 26.64,23.78 | 22.08,39.07 23.05,38.44 23.07,38.2 23.07,36.43 21.65,35.06 21.65,35.02 21.61,34.99 21.61,28.51 21.62,28.51 22.2,28.51 22.2,25.5 22.24,25.44 22.55,25.21 23.99,25.21 24.12,24.99 24.12,24.96 24.23,24.92 25.01,24.92 25.06,24.81 25.12,24.72 25.21,24.53 25.96,24.53 26.6,23.79 26.65,23.79 26.64,23.78 | 22.08,39.07 22.08,39.08 | v21.73,39.08 21.67,39.07 22.08,39.07 | 26.64,23.78 26.6,23.75
  Bottom 0.254: U$11.G 8.65,8.75 v8.84,12.42 | v21.73,39.08 U1.5
N$35  (via drill 0.5)
  Top 0.254: U$11.B 7.02,11.01 7.02,14.91 7.15,15.03 16.57,15.03 16.58,15.04 16.58,18.79 16.59,18.81 26.22,18.81 26.22,23.61 25.76,24.07 24.81,24.07 24.8,24.14 24.77,24.43 24.72,24.54 23.9,24.54 23.85,24.53 23.85,24.63 23.66,24.82 22.01,24.82 21.74,24.55 21.74,25.07 21.74,25.14 21.74,28.02 21.65,28.12 21.14,28.12 21.14,35.22 21.13,35.23 21.14,35.23 22.26,36.35 22.26,36.37 22.53,36.64 22.58,36.64 22.67,36.73 22.67,37.8 22.64,37.84 22.09,38.33 v22.26,38.1
  Bottom 0.254: U1.6 20.88,38.62 21.25,38.25 21.38,38.12 21.97,38.09 v22.26,38.1
N$36  (via drill 0.5, 0.6)
  Top 0.254: v15.14,33.27 13.94,33.43 12.72,34.58 12.57,34.8 12.09,35.29 12.09,37.26 11.99,37.36 11.75,37.33 11.09,37.34 v11.07,42.52 | U$15.R 10.86,50.3 11.99,49.17 11.99,46.32 13.71,44.6 v13.75,44.6
  Bottom 0.254: v15.14,33.27 15.98,33.12 15.99,33.11 16.48,33.09 21.71,33.09 21.73,33.11 21.73,36.38 21.08,37.03 21.08,37.77 20.81,38.04 20.33,38.04 U1.7 | v11.07,42.52 11.08,42.54 11.08,44.35 11.34,44.6 v13.75,44.6
N$37  (via drill 0.5)
  Top 0.254: U$15.G 8.66,46.77 8.66,45.5 8.77,45.39 12.07,45.39 12.71,44.76 12.71,44.33 13.25,43.78 13.66,43.78 14.27,43.17 v14.27,43.09 | v14.51,34.25 13.88,34.25 12.6,35.53 12.6,35.8 12.61,35.82 12.61,39.76 12.49,39.88 12.49,40.17 12.15,40.52 12.15,42.71 v12.24,42.7
  Bottom 0.254: v14.51,34.25 15.06,34.11 15.88,33.9 15.94,33.87 16.3,33.52 21.27,33.52 21.3,33.55 21.3,36.16 21.26,36.2 21.26,36.31 20.44,37.13 20.44,37.44 U1.8 | v12.24,42.7 12.27,42.74 13.89,42.74 14.24,43.09 v14.27,43.09
N$38  (via drill 0.5)
  Top 0.254: U$15.B 6.8,49.14 6.8,44.82 7.57,44.06 11.97,44.06 12.61,43.34 13.11,43.34 13.11,35.82 13.09,35.8 13.59,35.3 v15.66,34.97
  Bottom 0.254: v15.66,34.97 15.7,34.37 15.74,34.33 16.18,34.33 16.52,33.98 16.66,33.98 16.67,33.99 20.89,33.99 20.8,34.09 20.8,36.14 20.07,36.87 20.07,36.89 U1.9
N$39  (via drill 0.3, 0.5)
  Top 0.254: v21.45,44.37 20.82,42.55 19.57,41.26 19.52,37.12 19.87,36.81 19.87,35.27 19.71,35.14 v19.71,34.74 | U$18.R 30.27,49.41 30.13,49.27 28.86,49.27 28.64,49.06 v28.52,44.34
  Bottom 0.254: U1.10 19.07,36.66 19.02,36.61 19.05,36.59 19.05,36.33 19.11,36.22 19.69,36.22 19.87,36.09 19.87,35.3 19.71,35.14 v19.71,34.74 | v21.45,44.37 21.35,44.31 21.6,43.84 22.64,43.84 23.31,43.39 26.08,43.39 26.08,43.41 27.16,44.21 27.41,44.32 27.84,44.34 v28.52,44.34
N$40  (via drill 0.3, 0.5)
  Top 0.254: v19.26,35.57 19.25,35.58 19.23,35.9 19.04,36.54 19.16,41.88 20,42.48 20.04,42.54 20.02,42.57 v20.31,44.28 | v27.72,43.71 27.9,43.93 U$18.G
  Bottom 0.254: U1.11 18.58,36.84 18.58,36.25 18.55,36.14 18.59,36.1 18.59,35.68 19.15,35.46 v19.26,35.57 | v20.31,44.28 20.99,43.11 21.4,43.11 21.62,43.32 22.66,43.32 23.11,42.98 26.31,42.98 27.12,43.68 v27.72,43.71
N$41  (via drill 0.3, 0.5)
  Top 0.254: U$18.B 26.92,49 v26.67,48.63 | v22.17,47.66 22.18,45.14 v22.18,42.57 | v19.44,43.47 18.6,42.23 18.6,34.96 arc90 v18.86,34.63
  Bottom 0.254: v26.67,48.63 25.82,47.64 v22.17,47.66 | U1.14 17.03,36.29 17.1,36.22 17.44,36.22 17.77,35.88 v18.86,34.63 | v19.44,43.47 19.62,42.57 v22.18,42.57
N$42  (via drill 0.5)
  Top 0.254: v12.23,27.79 16.51,32.06 16.51,35.58 v16.2,35.89
  Bottom 0.254: U$12.R 10.36,27.79 v12.23,27.79 | v16.2,35.89 16.4,35.96 U1.15
N$43  (via drill 0.5)
  Top 0.254: v11.71,31.48 13.06,30.13 v13.49,30.14
  Bottom 0.254: U$12.G 8.86,31.43 v11.71,31.48 | U1.16 13.76,34.57 13.76,30.17 v13.49,30.14
N$44
  Bottom 0.254: U$12.B 10.44,30.41 12.73,30.41 13.24,30.92 13.26,35.33 13.37,35.44 U1.17
N$45  (via drill 0.3, 0.5)
  Top 0.254: v13.85,37.06 16.72,37.22 16.91,37.03 16.91,31.69 v16.48,31
  Bottom 0.254: U1.18 14.78,38.12 v13.85,37.06 | v16.48,31 16.86,31.03 16.86,31.04 17.69,31.86 18.59,31.86 19.48,30.96 26.48,30.98 26.83,30.62 26.81,29.52 26.93,29.4 27.23,29.4 27.59,29.22 28.16,29.22 28.65,29.45 30.16,29.45 30.27,29.56 U$13.R
N$46  (via drill 0.3, 0.5)
  Top 0.254: v13.76,38.08 13.96,38.14 16.12,38.37 | 16.12,38.37 16.32,38.37 | v18.13,30.98 17.3,30.75 17.3,35.81 17.33,37.44 17.02,37.48 16.12,38.37
  Bottom 0.203: 26.32,29.5 26.99,28.83 26.99,28.82
  Bottom 0.254: U1.19 15.27,38.58 14.8,38.58 14.69,38.61 v13.76,38.08 | U$13.G 27.74,28.8 26.99,28.82 | 26.32,29.5 26.32,30.56 19.88,30.56 18.56,30.56 v18.13,30.98
N$47  (via drill 0.3, 0.5)
  Top 0.254: v19.73,31.81 17.98,33.56 17.73,33.56 17.72,33.55 17.72,37.56 17.58,37.89 17.43,38.01 16.32,39.11 v13.9,39.09
  Bottom 0.254: U$13.B 26.22,31.81 v19.73,31.81 | v13.9,39.09 14.2,39.2 U1.20
N$48  (via drill 0.3, 0.5)
  Top 0.254: v45.52,36.85 45.42,36.61 45.42,35.05 45.21,34.85 45.07,34.71 45.07,34.25 44.76,33.94 44.76,32.32 45.62,31.47 45.63,31.47 45.63,30.53 45.38,30.28 v45.16,30.08 | v45.06,39.62 44.92,38.58 43.96,37.62 43.96,36.92 v44.07,36.81
  Bottom 0.254: v45.06,39.62 43.59,39.62 U2.4 | v45.16,30.08 45.1,30.27 U$16.R | v45.52,36.85 44.11,36.85 v44.07,36.81
N$49  (via drill 0.5)
  Top 0.254: v48.13,38.79 arc-90 48.33,38.59 48.33,34.29 48.77,33.85 49.7,33.85 49.71,33.84 49.71,31.97 49.73,31.94 48.73,31.94 48.71,31.92 48.71,31.3 48.74,31.27 48.74,27.85 50.3,27.85 U$16.G
  Bottom 0.254: U2.5 41.85,39.11 42.79,39.11 43.12,38.79 v48.13,38.79
N$50  (via drill 0.3)
  Top 0.254: v46.26,38.12 46.26,36.23 45.81,35.78 45.81,34.84 45.58,34.66 45.58,34.65 45.49,34.56 45.49,34.11 45.16,33.78 45.16,32.48 45.58,32.06 46.04,31.65 46.04,31.63 46.14,31.53 46.14,27.76 46.17,27.73 U$16.B
  Bottom 0.254: U2.6 42.51,38.62 42.85,38.28 46.1,38.28 v46.26,38.12
N$51  (via drill 0.3)
  Top 0.127: 33.35,19.2 33.39,22.86 37.05,22.86 37.06,22.88 37.06,24.79 37.08,24.85 37.26,24.86 37.79,25.27 37.78,25.7 v37.5,25.67
  Top 0.254: U$17.R 31.2,11.23 32.38,11.23 32.39,11.25 32.39,11.81 32.87,12.29 32.87,14.25 32.64,14.48 32.1,14.48 32.04,14.54 32.04,15.17 32.03,15.18 31.61,15.18 31.09,15.69 31.09,19.03 33.35,19.03 33.35,19.2 | v47.79,31.48 47.79,31.88 48.42,32.51 48.42,33.49 47.92,33.99 47.92,34.21 47.92,36.71 47.65,36.99 v47.65,37.02
  Bottom 0.127: 42.16,26.47 41.92,26.08 41.48,26.08 41.33,25.93 38.97,25.93 38.71,25.67 v37.5,25.67
  Bottom 0.254: 42.16,26.47 45.84,26.47 46.12,26.61 48.58,26.61 48.61,26.58 48.61,31.47 48.63,31.49 47.81,31.49 v47.79,31.48 | 47.62,37.05 v47.65,37.01 v47.65,37.02 47.36,37.3 46.17,37.3 45.86,37.61 44.99,37.61 44.79,37.81 42.6,37.81 42.29,38.12 U2.7
N$52  (via drill 0.3)
  Top 0.127: 30.7,19.37 30.7,19.45 | 30.7,19.46 30.7,19.45 | 30.7,19.45 33.07,19.45 33.06,23.14 36.75,23.14 36.8,23.16 36.8,24.97 36.9,25.07 36.9,26.71 v37.4,27.15
  Top 0.254: U$17.B 28.28,10.85 28.28,11.53 28.32,11.65 28.33,11.67 30.82,11.67 31.23,12.08 31.27,12.12 31.27,14.1 31.26,14.11 31.26,14.24 30.63,14.87 30.63,17.57 30.7,17.65 30.7,19.37 | 37.51,27.31 v37.4,27.15 | v40.55,27.16 40.54,31.38 41.46,32.03 41.46,33.61 41.39,33.68 41.05,34.01 40.99,34.08 40.99,36.37 v41.86,36.7
  Bottom 0.254: U2.9 41.44,36.58 v41.86,36.7 | 40.52,27.27 v40.55,27.16 40.53,27.15 v37.4,27.15
N$53  (via drill 0.5)
  Top 0.254: U$14.R 50.27,11.43 50.04,11.66 49.65,11.66 48.73,12.58 48.73,15.3 48.73,24.01 48.58,24.01 45.92,24.01 44.36,25.44 44.36,31.16 43.68,31.85 43.68,34.16 44.16,34.73 44.16,35.66 v44.27,35.68
  Bottom 0.254: U2.10 40.62,36.12 40.59,36.09 42.96,36.09 43.39,35.66 44.25,35.66 v44.27,35.68
N$54  (via drill 0.3)
  Top 0.127: 30.29,19.59 30.29,19.78 32.77,19.79 32.76,23.43 36.22,23.42 36.48,23.42 36.53,23.47 36.53,25.45 36.62,25.58 36.62,27.2 36.44,27.41
  Top 0.203: 36.44,27.41 36.33,27.53 36.33,30.45 36.49,30.61 37.36,30.61 37.45,30.69 37.45,31.7 37.23,31.91 37.13,31.91 37.08,31.97 37.08,32.92 37.27,32.99 v37.31,32.99
  Top 0.254: U$17.G 26.94,8.49 26.94,10.95 26.92,11.18 27.78,11.18 27.84,11.24 27.84,11.86 27.96,12.04 28.01,12.09 30.66,12.09 30.85,12.29 30.85,12.94 30.81,12.98 30.81,14.11 30.16,14.77 30.16,17.59 30.31,17.95 30.29,19.59 | 42.87,37.09 v42.64,37.09 | v42.64,37.09 42.37,37.09 41.88,37.58 41.88,37.65 41.86,37.67 40.75,37.67 40.52,37.43 40.52,33.68 40.95,33.25 v40.8,33.19 | v42.65,37.1 v42.64,37.09
  Bottom 0.203: 40.48,33.02 v37.31,32.99
  Bottom 0.254: U2.8 42.11,37.36 | 42.11,37.36 42.14,37.36 | 42.11,37.36 42.36,37.1 v42.65,37.1 | v40.8,33.19 40.74,33.02 40.48,33.02
N$55  (via drill 0.5)
  Top 0.254: v48.22,11.83 48.22,14.32 48.22,23.23 47.89,23.56 45.7,23.56 43.98,25.21 43.98,30.85 43.21,31.62 43.21,34.81 v43.32,34.92
  Bottom 0.254: U2.11 40.12,35.46 40.14,35.48 42.91,35.48 v43.32,34.92 | v48.22,11.83 49,11.48 49,9.27 47.73,8 U$14.G
N$56  (via drill 0.3)
  Top 0.254: v42.22,34.73 42.73,34.43 42.73,31.43 43.55,30.48 43.55,24.98 45.43,23.14 46.92,23.14 47.73,22.33 47.73,15.16 47.73,15.15 47.73,13.21 47.4,13.21 47.4,10.3 U$14.B
  Bottom 0.254: U2.14 38.74,36.32 39.54,35.74 39.47,34.9 39.47,34.89 41.15,34.89 41.33,34.71 v42.22,34.73
N$57
  Bottom 0.254: U5.3 U5.2
N$58  (via drill 0.3)
  Top 0.254: v38.43,35.79 38.73,35.94 38.77,39.56 38.48,39.86 38.48,44.83 38.77,45.12 v38.77,46.18 | v46.46,47.41 46.85,47.9 46.85,48.83 47.46,49.34 50.27,49.34 U$19.R
  Bottom 0.254: U2.15 38.14,36.88 38.17,36.2 38.44,35.87 v38.43,35.79 | v46.46,47.41 40.41,47.39 v38.77,46.18
N$59  (via drill 0.3)
  Top 0.254: v37.56,36.15 38.07,36.55 38.07,39.47 38.05,39.82 38.05,44.88 38.07,44.9 38.07,46.93 40.06,46.93 v40.43,46.56
  Bottom 0.254: U2.16 37.72,36.79 v37.56,36.15 | v40.43,46.56 40.52,46.91 45.95,46.91 46.29,46.63 46.91,46.63 47.73,47.46 U$19.G
N$60  (via drill 0.3)
  Top 0.127: 36.55,36.62 36.53,36.56 36.53,34.86 35.73,34.11 35.73,33.49 36.64,32.58 36.64,31.85 36.64,31.4 v36.63,31.28
  Top 0.254: v36.6,36.8 36.55,36.62 | v45.02,31.15 44.79,31.28 44.79,31.43 44.14,32.09 44.14,33.93 44.63,34.42 44.63,34.83 44.79,34.99 45.02,35.2 45.02,36.19 44.73,36.73 44.71,36.75 44.71,37.35 45.21,37.85 45.48,37.85 45.5,37.87 45.5,39.03 46.14,39.67 48.13,39.67 48.56,40.1 v48.56,46.46
  Bottom 0.254: U2.17 36.7,37.43 v36.6,36.8 | v36.63,31.28 36.85,31.14 v45.02,31.15 | v48.56,46.46 48.62,46.55 48.62,49.09 47.73,49.99 U$19.B
N$61  (via drill 0.3, 0.5)
  Top 0.254: v21.04,45.72 20.35,45.72 20.15,45.52 19.65,45.52 19.24,45.04 19.24,44.34 17.57,42.74 17.57,40.69 17.64,40.62 U1.23 arc90 U1.23 14.79,40.76 v13.79,40.95 | v46.71,45.35 46.73,45.31 v46.72,40.91
  Bottom 0.127: 28.33,45.77 32.19,45.77 | 32.19,45.77 32.2,45.77 | 32.19,45.77 32.19,46.23 35.89,46.23 36.23,45.89 36.23,45.55 36.25,45.53
  Bottom 0.254: 14.85,40.62 U1.23 v13.79,40.95 | v21.04,45.72 21.31,46 21.76,46 21.91,46.14 21.91,46.42 21.92,46.44 28.3,46.44 28.31,46.43 28.31,45.79 28.33,45.77 | U2.2 41.86,40.63 42.6,40.63 42.8,40.84 42.8,40.98 43.19,41.38 43.89,41.38 44.19,41.07 46.56,41.07 v46.72,40.91 | v46.71,45.35 45.01,45.35 44.82,45.51 36.25,45.53
N$62  (via drill 0.6)
  Top 0.254: v14.17,6.83 13.91,7.1 1.1
  Bottom 0.254: R15.2 v14.17,6.83
N$63  (via drill 0.5)
  Top 0.254: v16.27,42.97 16.27,43.33 16.45,43.56 16.49,50.37 v17.41,51.16
  Bottom 0.254: U1.26 16.53,42.64 v16.27,42.97 | v17.41,51.16 17.43,52.39 R14.1
N$64  (via drill 0.5)
  Top 0.254: v32.11,10.49 33.06,10.72 U$22.1
  Bottom 0.254: R16.2 32.11,5.05 v32.11,10.49
N$65  (via drill 0.5)
  Top 0.254: v36.95,42.54 36.78,42.59 36.78,46.77 | 36.78,46.77 | 36.78,46.77 36.58,46.77 36.38,46.98 36.38,50.87 v36.78,51.27
  Bottom 0.254: v36.95,42.54 38,42.53 U2.26 | v36.78,51.27 38.05,51.27 R13.1
N$66  (via drill 0.6)
  other vias: 11.15,18.17
N$67  (via drill 0.6)
  other vias: 8.73,20.93
N$68  (via drill 0.6)
  other vias: 10.19,20.98
N$69  (via drill 0.6)
  other vias: 11.77,20.98
N$70  (via drill 0.6)
  other vias: 13.22,20.98
N$72  (via drill 0.3)
  Top 0.254: v31.47,42.59 32.17,43.27 v32.17,50.7 | v27.57,51.96 23.16,56.17 21.35,56.17 20.96,56.56 8.39,56.56 4.67,52.84 3.17,52.84 2.96,52.63 2.96,43.63 v4.2,43.63
  Bottom 0.254: U6.6 4.22,38.73 4.22,38.71 4.19,38.71 4.19,42.95 | 4.19,42.95 8.24,42.95 C30.1 | U5.31 30.25,42.45 30.52,42.71 30.68,42.55 v31.47,42.59 | v32.17,50.7 31.81,51.17 29.03,51.17 28.14,51.96 v27.57,51.96 | v4.2,43.63 v4.19,43.63 4.19,42.95
N$74  (via drill 0.5)
  Top 0.254: v18.57,25.67 20.33,25.67 v20.58,25.42
  Bottom 0.203: R34.1
  Bottom 0.254: 20.77,25.17 25.72,25.17 arc-90 25.78,25.11 25.78,23.54 25.75,23.51 CC3200.34 | 20.77,25.17 arc-90 20.76,25.18 | 20.77,25.17 v20.58,25.42 | R34.1 18.08,25.18 v18.57,25.67
N$75  (via drill 0.3)
  Top 0.254: SV1.2 26.85,2.54 28.64,4.34 29.87,4.34 30.26,4.73 32,4.73 32.02,4.75 32.02,4.85 33.08,5.91 33.11,5.91 33.25,6.05 34.1,6.05 34.1,8.1 34.09,8.11 34.09,8.77 34.36,9.04 35.57,9.04 35.77,9.32 35.77,12.01 35.62,12.18 35.59,13.62 36.79,14.54 36.79,18.05 36.52,18.32 36.52,18.74 36.42,18.84 35.83,18.84 35.71,18.96 35.71,19.5 v35.71,20.09
  Bottom 0.254: CC3200.55 33.42,19.8 v35.71,20.09
N$76  (via drill 0.3)
  Top 0.254: SV1.3 30.67,4.33 32.53,4.33 32.53,4.6 33.17,5.24 33.19,5.24 33.49,5.54 34.56,5.54 34.6,5.59 34.55,8.22 34.93,8.56 36.07,8.56 36.23,8.86 36.23,12.15 36.02,12.33 36.05,13.43 36.57,13.8 36.88,13.8 37.19,14.23 v37.2,18.82
  Bottom 0.254: CC3200.57 33.45,18.82 v37.2,18.82
N$77  (via drill 0.6)
  other vias: 4.34,16.91
N$78  (via drill 0.6)
  other vias: 6.14,16.96
N$79  (via drill 0.6)
  other vias: 7.62,16.96
N$80  (via drill 0.6)
  other vias: 8.64,19.25
N$81  (via drill 0.6)
  other vias: 8.71,18.09
N$82  (via drill 0.6)
  other vias: 15.05,20.95
N$83  (via drill 0.6)
  Top 0.305: v54.33,7.01 53.06,7.01 U$23.1
  Bottom 0.305: R17.2 54.33,5.08 | 54.33,5.08 54.33,4.98 | 54.33,5.08 v54.33,7.01
N$84  (via drill 0.6)
  Top 0.254: v6.68,23.93 7.1,23.93 U$24.1
  Bottom 0.254: R18.2 6.68,23.94 v6.68,23.93
N$85  (via drill 0.3)
  Top 0.254: U$25.1 33.77,27.8 33.77,31.37 33.95,31.55 v34.22,31.64
  Bottom 0.254: v34.22,31.64 34.17,31.68 R19.2
N$86  (via drill 0.5)
  Top 0.254: v48.99,24.87 48.92,24.94 U$26.1
  Bottom 0.254: R20.2 52.88,23.98 49.2,23.98 48.99,24.2 v48.99,24.87